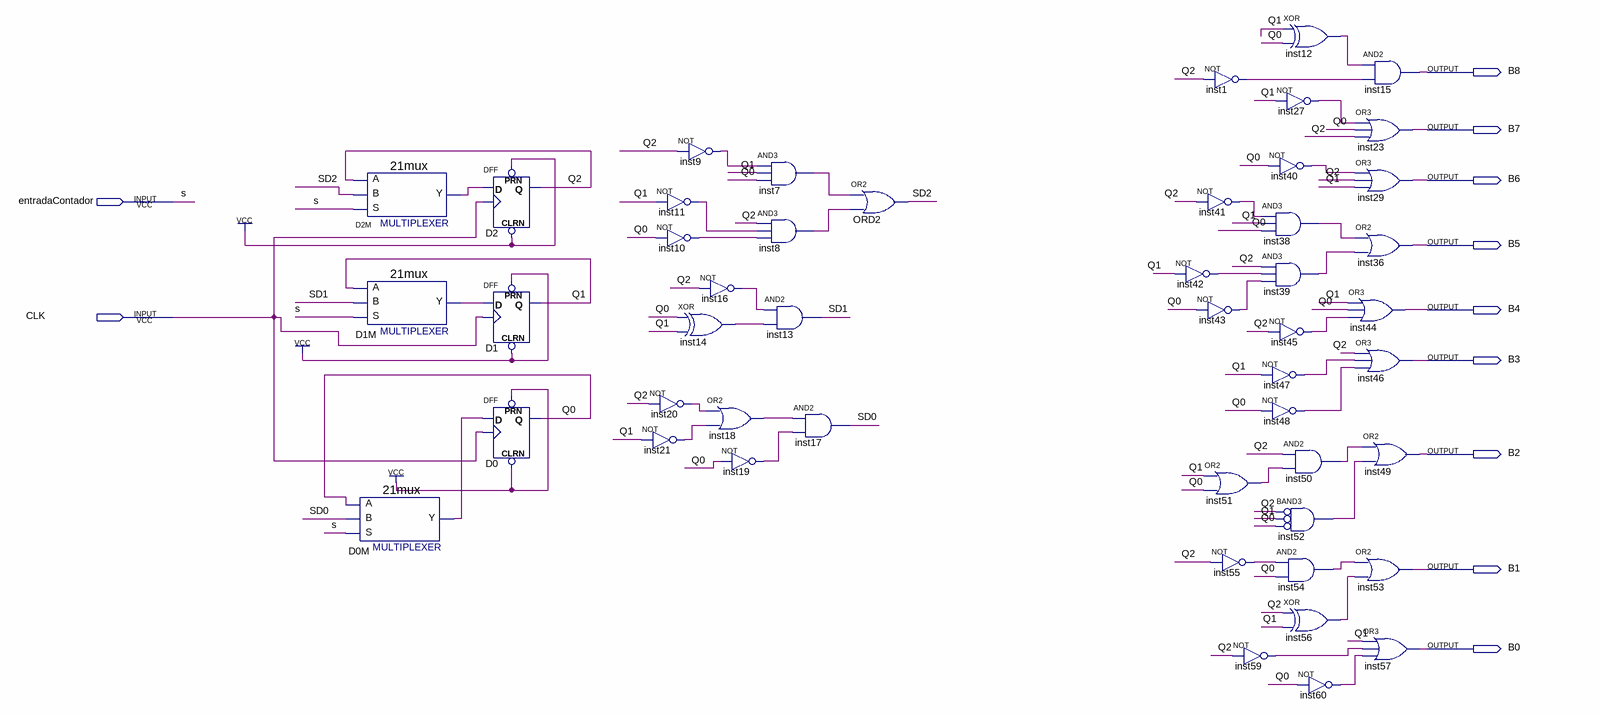
[diagram p0: schematic sheet]
// Quartus schematic maquina.bdf as structural Verilog: 49 symbols, 11 pins
module maquina (
  input  entradaContador,
  input  CLK,
  output B8,
  output B7,
  output B6,
  output B5,
  output B4,
  output B3,
  output B2,
  output B1,
  output B0
);

  wire D0M_y, D1M_y, D2M_y, inst1_out, inst7_out, inst8_out, inst9_out, inst10_out, inst11_out, inst12_out,
       inst14_out, inst16_out, inst18_out, inst19_out, inst20_out, inst21_out, inst27_out, inst38_out,
       inst39_out, inst40_out, inst41_out, inst42_out, inst43_out, inst45_out, inst47_out, inst48_out,
       inst50_out, inst51_out, inst52_out, inst54_out, inst55_out, inst56_out, inst59_out, inst60_out, Q0,
       Q1, Q2, SD0, SD1, SD2;

  \21mux  D2M (.S(entradaContador), .B(SD2), .A(Q2), .Y(D2M_y));
  \21mux  D1M (.S(entradaContador), .B(SD1), .A(Q1), .Y(D1M_y));
  \21mux  D0M (.S(entradaContador), .B(SD0), .A(Q0), .Y(D0M_y));
  DFF D2 (.CLRN(1'b1), .CLK(CLK), .D(D2M_y), .PRN(1'b1), .Q(Q2));
  DFF D1 (.CLRN(1'b1), .CLK(CLK), .D(D1M_y), .PRN(1'b1), .Q(Q1));
  DFF D0 (.CLRN(1'b1), .CLK(CLK), .D(D0M_y), .PRN(1'b1), .Q(Q0));
  not inst21 (inst21_out, Q1);
  not inst9 (inst9_out, Q2);
  not inst11 (inst11_out, Q1);
  not inst10 (inst10_out, Q0);
  not inst16 (inst16_out, Q2);
  xor inst14 (inst14_out, Q0, Q1);
  not inst20 (inst20_out, Q2);
  and inst7 (inst7_out, inst9_out, Q1, Q0);
  and inst8 (inst8_out, Q2, inst11_out, inst10_out);
  or inst18 (inst18_out, inst20_out, inst21_out);
  not inst19 (inst19_out, Q0);
  and inst13 (SD1, inst16_out, inst14_out);
  and inst17 (SD0, inst18_out, inst19_out);
  or ORD2 (SD2, inst7_out, inst8_out);
  not inst1 (inst1_out, Q2);
  not inst41 (inst41_out, Q2);
  not inst42 (inst42_out, Q1);
  not inst43 (inst43_out, Q0);
  or inst51 (inst51_out, Q1, Q0);
  not inst55 (inst55_out, Q2);
  not inst27 (inst27_out, Q1);
  not inst40 (inst40_out, Q0);
  and inst38 (inst38_out, inst41_out, Q1, Q0);
  and inst39 (inst39_out, Q2, inst42_out, inst43_out);
  not inst45 (inst45_out, Q2);
  not inst47 (inst47_out, Q1);
  not inst48 (inst48_out, Q0);
  and inst52 (inst52_out, ~Q2, ~Q1, ~Q0);  // BAND3
  and inst54 (inst54_out, inst55_out, Q0);
  not inst59 (inst59_out, Q2);
  xor inst12 (inst12_out, Q1, Q0);
  and inst50 (inst50_out, Q2, inst51_out);
  xor inst56 (inst56_out, Q2, Q1);
  not inst60 (inst60_out, Q0);
  and inst15 (B8, inst12_out, inst1_out);
  or inst23 (B7, inst27_out, Q0, Q2);
  or inst29 (B6, inst40_out, Q2, Q1);
  or inst36 (B5, inst38_out, inst39_out);
  or inst44 (B4, Q1, Q0, inst45_out);
  or inst46 (B3, Q2, inst47_out, inst48_out);
  or inst49 (B2, inst50_out, inst52_out);
  or inst53 (B1, inst54_out, inst56_out);
  or inst57 (B0, Q1, inst59_out, inst60_out);

  // Other names for the same wires on the sheet: s = entradaContador
endmodule
